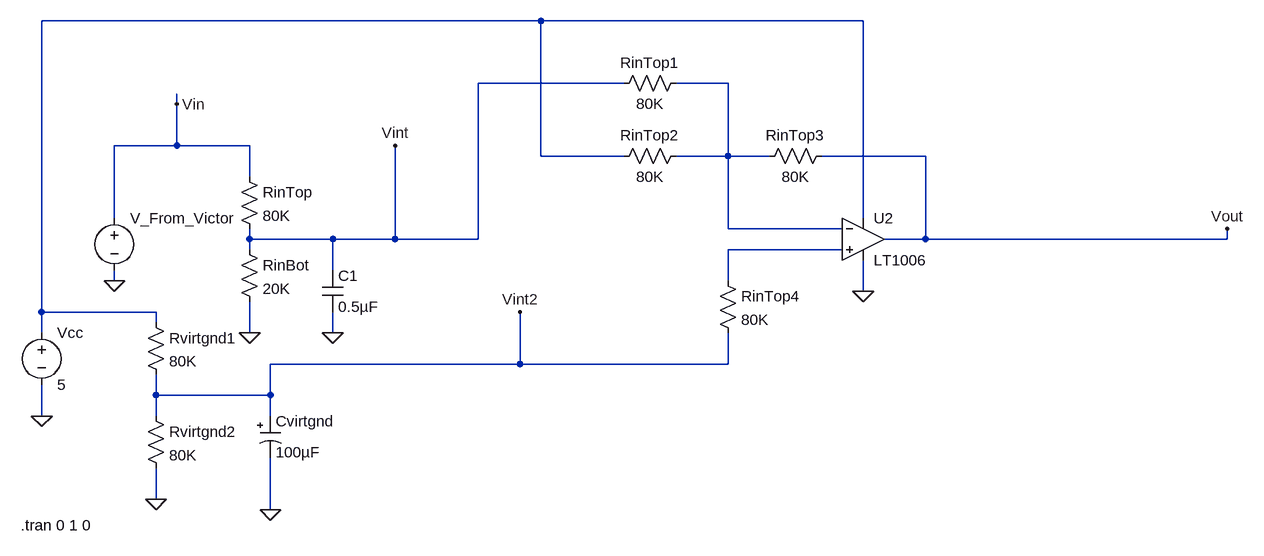
[diagram p0: schematic RoboSim PWM Input Filter.asc]
RoboSim PWM Input Filter.asc, the LTspice schematic file:
Version 4
SHEET 1 1520 680
WIRE 432 -320 -336 -320
WIRE 928 -320 432 -320
WIRE 560 -224 336 -224
WIRE 720 -224 640 -224
WIRE -128 -192 -128 -208
WIRE -128 -128 -128 -192
WIRE -128 -128 -224 -128
WIRE -16 -128 -128 -128
WIRE 432 -112 432 -320
WIRE 560 -112 432 -112
WIRE 720 -112 720 -224
WIRE 720 -112 640 -112
WIRE 784 -112 720 -112
WIRE 1024 -112 864 -112
WIRE -16 -80 -16 -128
WIRE -224 -16 -224 -128
WIRE 928 -16 928 -320
WIRE 720 0 720 -112
WIRE 896 0 720 0
WIRE -16 16 -16 0
WIRE 112 16 -16 16
WIRE 208 16 208 -128
WIRE 208 16 112 16
WIRE 336 16 336 -224
WIRE 336 16 208 16
WIRE 1024 16 1024 -112
WIRE 1024 16 960 16
WIRE 1488 16 1488 0
WIRE 1488 16 1024 16
WIRE -16 32 -16 16
WIRE 896 32 720 32
WIRE 112 64 112 16
WIRE -224 80 -224 64
WIRE 720 80 720 32
WIRE 928 96 928 48
WIRE -336 128 -336 -320
WIRE -160 128 -336 128
WIRE -160 144 -160 128
WIRE -336 160 -336 128
WIRE -16 160 -16 112
WIRE 112 160 112 128
WIRE 400 208 400 128
WIRE 400 208 16 208
WIRE 720 208 720 160
WIRE 720 208 400 208
WIRE -160 256 -160 224
WIRE 16 256 16 208
WIRE 16 256 -160 256
WIRE -336 288 -336 240
WIRE -160 288 -160 256
WIRE 16 288 16 256
WIRE -160 416 -160 368
WIRE 16 432 16 352
FLAG -224 80 0
FLAG -336 288 0
FLAG -16 160 0
FLAG -160 416 0
FLAG 16 432 0
FLAG 1488 0 Vout
FLAG -128 -192 Vin
FLAG 112 160 0
FLAG 208 -128 Vint
FLAG 400 128 Vint2
FLAG 928 96 0
SYMBOL voltage -224 -32 R0
WINDOW 3 24 96 Invisible 2
WINDOW 123 0 0 Left 2
SYMATTR Value PULSE(0 12 0 0 0 0.0000111111 0.0000666666 750)
SYMATTR InstName V_From_Victor
SYMATTR SpiceLine Rser=0 Cpar=0
SYMBOL voltage -336 144 R0
WINDOW 123 0 0 Left 2
SYMATTR InstName Vcc
SYMATTR Value 5
SYMATTR SpiceLine Rser=0
SYMBOL res -32 -96 R0
SYMATTR InstName RinTop
SYMATTR Value 80K
SYMATTR SpiceLine tol=1 pwr=0.1
SYMBOL res -32 16 R0
SYMATTR InstName RinBot
SYMATTR Value 20K
SYMATTR SpiceLine tol=1 pwr=0.1
SYMBOL res -176 128 R0
SYMATTR InstName Rvirtgnd1
SYMATTR Value 80K
SYMATTR SpiceLine tol=1 pwr=0.1
SYMBOL res -176 272 R0
SYMATTR InstName Rvirtgnd2
SYMATTR Value 80K
SYMATTR SpiceLine tol=1 pwr=0.1
SYMBOL polcap 0 288 R0
WINDOW 3 24 56 Left 2
SYMATTR Value 100µF
SYMATTR InstName Cvirtgnd
SYMATTR Description Capacitor
SYMATTR Type cap
SYMATTR SpiceLine V=25 Irms=2.22 Rser=0.024 Lser=0
SYMBOL Opamps\\LT1006 928 -48 R0
SYMATTR InstName U2
SYMBOL cap 96 64 R0
SYMATTR InstName C1
SYMATTR Value 0.5µF
SYMBOL res 656 -240 R90
WINDOW 0 0 56 VBottom 2
WINDOW 3 32 56 VTop 2
SYMATTR InstName RinTop1
SYMATTR Value 80K
SYMATTR SpiceLine tol=1 pwr=0.1
SYMBOL res 656 -128 R90
WINDOW 0 0 56 VBottom 2
WINDOW 3 32 56 VTop 2
SYMATTR InstName RinTop2
SYMATTR Value 80K
SYMATTR SpiceLine tol=1 pwr=0.1
SYMBOL res 880 -128 R90
WINDOW 0 0 56 VBottom 2
WINDOW 3 32 56 VTop 2
SYMATTR InstName RinTop3
SYMATTR Value 80K
SYMATTR SpiceLine tol=1 pwr=0.1
SYMBOL res 704 64 R0
SYMATTR InstName RinTop4
SYMATTR Value 80K
SYMATTR SpiceLine tol=1 pwr=0.1
TEXT -368 456 Left 2 !.tran 0 1 0

The netlist it stands for:
* RoboSim PWM Input Filter.asc
V_From_Victor Vin 0 PULSE(0 12 0 0 0 0.0000111111 0.0000666666 750) Rser=0 Cpar=0
Vcc N001 0 5 Rser=0
RinTop Vin Vint 80K tol=1 pwr=0.1
RinBot Vint 0 20K tol=1 pwr=0.1
Rvirtgnd1 N001 Vint2 80K tol=1 pwr=0.1
Rvirtgnd2 Vint2 0 80K tol=1 pwr=0.1
Cvirtgnd Vint2 0 100µF V=25 Irms=2.22 Rser=0.024 Lser=0
XU2 N003 N002 N001 0 Vout LT1006  ; pins In+ In- V+ V- OUT
C1 Vint 0 0.5µF
RinTop1 N002 Vint 80K tol=1 pwr=0.1
RinTop2 N002 N001 80K tol=1 pwr=0.1
RinTop3 Vout N002 80K tol=1 pwr=0.1
RinTop4 N003 Vint2 80K tol=1 pwr=0.1
.tran 0 1 0
.lib LTC.lib
.backanno
.end